# EAGLE schematic tribometer-adc (EAGLE 9.6.2)
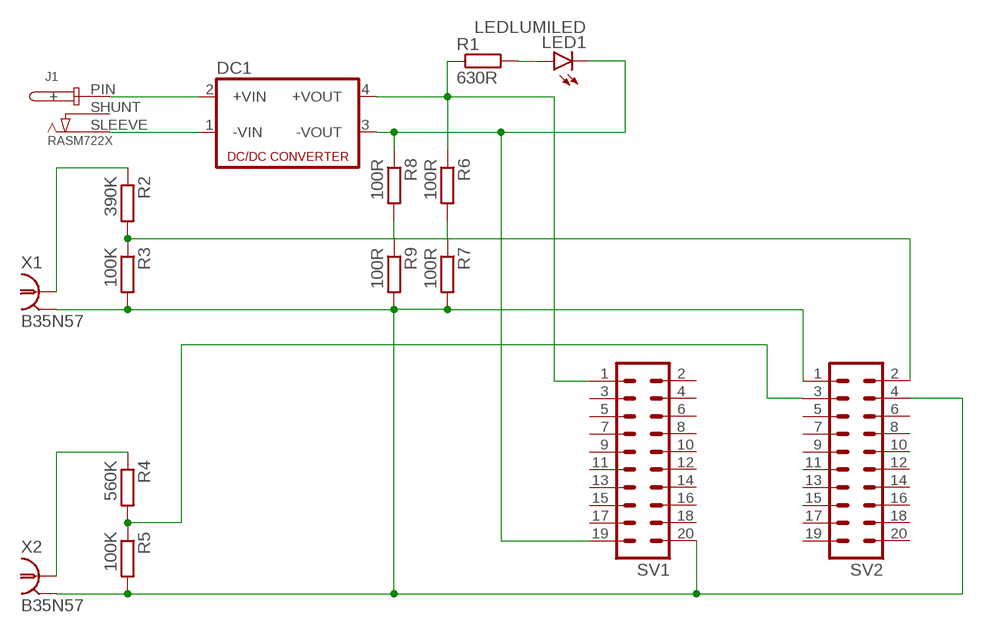
[diagram p0: schematic, sheet 1]

## Parts
DC1  NME  [NME]
J1  RASM722X  [RASM722X]
LED1  LEDLUMILED  [LUMILED]
R1  630R  R-EU_0207/12  [0207/12]
R2  390K  R-EU_0207/12  [0207/12]
R3  100K  R-EU_0207/12  [0207/12]
R4  560K  R-EU_0207/12  [0207/12]
R5  100K  R-EU_0207/12  [0207/12]
R6  100R  R-EU_0207/12  [0207/12]
R7  100R  R-EU_0207/12  [0207/12]
R8  100R  R-EU_0207/12  [0207/12]
R9  100R  R-EU_0207/12  [0207/12]
SV1  MA10-2  [MA10-2]
SV2  MA10-2  [MA10-2]
X1  B35N57  [B35N57]
X2  B35N57  [B35N57]

## Nets
N$1: DC1.2(+VIN) J1.PIN(+)
N$2: DC1.1(-VIN) J1.SLEEVE(NEG)
N$3: DC1.4(+VOUT) R1.1 R6.1 SV1.1
N$4: LED1.2+(A) R1.2
N$5: R8.2 R9.1
N$6: R4.1 X2.1
N$7: R2.1 X1.1
N$8: R2.2 R3.1 SV2.2
N$10: R4.2 R5.1 SV2.3
N$11: R6.2 R7.1
N$12: DC1.3(-VOUT) LED1.4-(C) R8.1 SV1.19
N$13: R3.2 R5.2 R7.2 R9.2 SV1.20 SV2.1 SV2.4 X1.2 X1.3 X1.4 X1.5 X2.2 X2.3 X2.4 X2.5
Unconnected: J1.SHUNT(-) SV1.2 SV1.3 SV1.4 SV1.5 SV1.6 SV1.7 SV1.8 SV1.9 SV1.10 SV1.11 SV1.12 SV1.13 SV1.14 SV1.15 SV1.16 SV1.17 SV1.18 SV2.5 SV2.6 SV2.7 SV2.8 SV2.9 SV2.10 SV2.11 SV2.12 SV2.13 SV2.14 SV2.15 SV2.16 SV2.17 SV2.18 SV2.19 SV2.20

## Library data of the parts
DC1 = dc-dc-converter:NME: DC-DC CONVERTER; MF: C & D TECHNOLOGIES, INC; MPN: NME1205D; OC_FARNELL: 1021466; OC_NEWARK: 98B8198
J1 = Connectors:RASM722X: CONN PWR JACK 2.1X5.5MM SOLDER Manufacturer's datasheet <http://www.switchcraft.com/Documents/EDG4.pdf#page=135>; CREATED_BY: PCBLayout.com; DIGI-KEY_PART_NO: RASM722X-ND; MANUFACTURER: Switchcraft Inc.; MPN: RASM722X
LED1 = led-lumiled:LED: LED - LUMILED® LXK2-PW12-R00, LXK2-PW12-S00, LXK2-PW14-U00, LXK2-PW14-V00 LXK2-PM12-R00, LXK2-PM12-S00, LXK2-PM14-U00 LXK2-PE12-Q00, LXK2-PE12-R00, LXK2-PE12-S00, LXK2-PE14-T00, LXK2-PE14-U00 LXK2-PB12-K00, LXK2-PB12-L00, LXK2-PB12-M00, LXK2-PB14-N00, LXK2-PB14-P00, LXK2-PB14-Q00 LXK2-PR12-L00, LXK2-PR12-M00, LXK2-PR14-Q00, LXK2-PR14-R00 LXK2-PD12-Q00, LXK2-PD12-R00, LXK2-PD12-S00 LXK2-PH12-R00, LXK2-PH12-S00 LXK2-PL12-P00, LXK2-PL12-Q00, LXK2-PL12-R00 Source: www.luxeon.com; OC_FARNELL: unknown; OC_NEWARK: unknown
R1-R9 = rcl:R-EU_: RESISTOR, European symbol; SPICEPREFIX: R
SV1 SV2 = con-lstb:MA10-2: PIN HEADER; OC_FARNELL: unknown; OC_NEWARK: unknown
X1 X2 = con-coax:B35N57: BNC CONNECTOR M/A COM www.macom.com; OC_FARNELL: unknown; OC_NEWARK: unknown